# Altium schematic sheet PSU.SchDoc
size A3; SheetNumber: 4; SheetTotal: 8
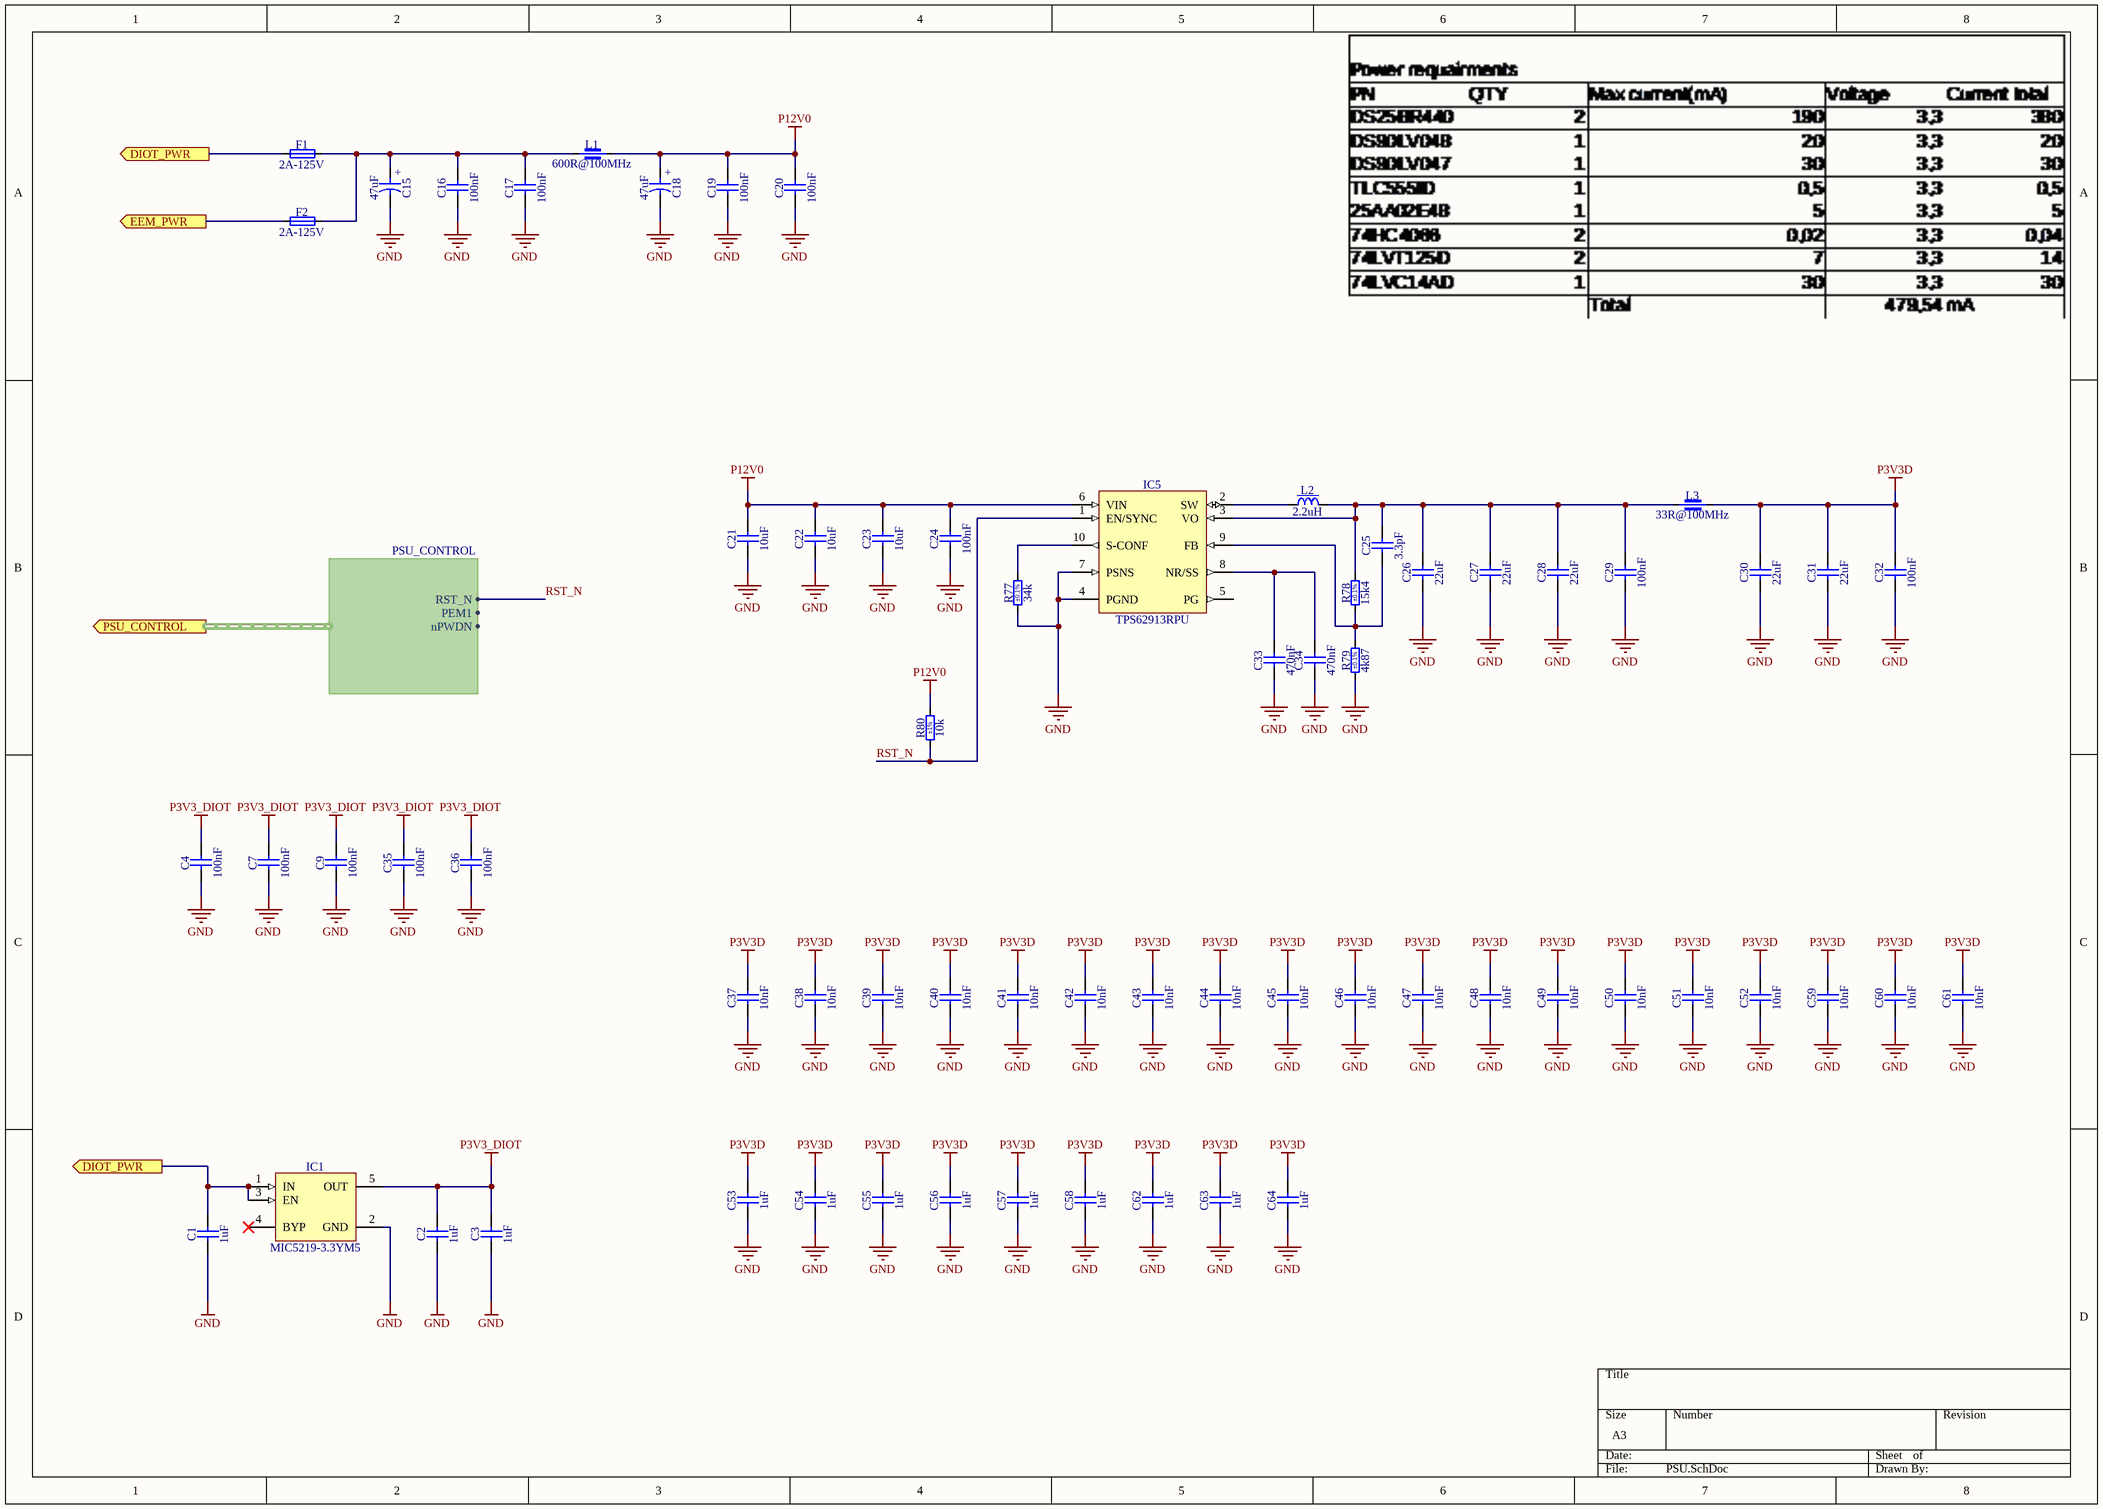
[diagram p0: PSU.SchDoc]

## Parts
C1  1uF  [CAPC1608X87N]
C2  1uF  [CAPC1005X55N]
C3  1uF  [CAPC1005X55N]
C4  100nF  [CAPC1005X55N]
C7  100nF  [CAPC1005X55N]
C9  100nF  [CAPC1005X55N]
C15  47uF  [CAPMP7343X310N]
C16  100nF  [CAPC1608X90N]
C17  100nF  [CAPC1608X90N]
C18  47uF  [CAPMP7343X310N]
C19  100nF  [CAPC1608X90N]
C20  100nF  [CAPC1608X90N]
C21  10uF  [CAPC3216X180N]
C22  10uF  [CAPC3216X180N]
C23  10uF  [CAPC3216X180N]
C24  100nF  [CAPC2012X135N]
C25  3.3pF  [CAPC1608X87N]
C26  22uF  [CAPC3216X180N]
C27  22uF  [CAPC3216X180N]
C28  22uF  [CAPC3216X180N]
C29  100nF  [CAPC3216X180N]
C30  22uF  [CAPC3216X180N]
C31  22uF  [CAPC3216X180N]
C32  100nF  [CAPC3216X180N]
C33  470nF  [CAPC1608X90N]
C34  470nF  [CAPC1608X90N]
C35  100nF  [CAPC1005X55N]
C36  100nF  [CAPC1005X55N]
C37  10nF  [CAPC1005X55N]
C38  10nF  [CAPC1005X55N]
C39  10nF  [CAPC1005X55N]
C40  10nF  [CAPC1005X55N]
C41  10nF  [CAPC1005X55N]
C42  10nF  [CAPC1005X55N]
C43  10nF  [CAPC1005X55N]
C44  10nF  [CAPC1005X55N]
C45  10nF  [CAPC1005X55N]
C46  10nF  [CAPC1005X55N]
C47  10nF  [CAPC1005X55N]
C48  10nF  [CAPC1005X55N]
C49  10nF  [CAPC1005X55N]
C50  10nF  [CAPC1005X55N]
C51  10nF  [CAPC1005X55N]
C52  10nF  [CAPC1005X55N]
C53  1uF  [CAPC2012X135N]
C54  1uF  [CAPC2012X135N]
C55  1uF  [CAPC2012X135N]
C56  1uF  [CAPC2012X135N]
C57  1uF  [CAPC2012X135N]
C58  1uF  [CAPC2012X135N]
C59  10nF  [CAPC1005X55N]
C60  10nF  [CAPC1005X55N]
C61  10nF  [CAPC1005X55N]
C62  1uF  [CAPC2012X135N]
C63  1uF  [CAPC2012X135N]
C64  1uF  [CAPC2012X135N]
F1  2A-125V  [FUSE_LITTELFUSE_0154]
F2  2A-125V  [FUSE_LITTELFUSE_0154]
IC1  MIC5219-3.3YM5  [SOT95P280X145-5N]
IC5  TPS62913RPU  [TEXAS_RPU0010A]
L1  600R@100MHz  [INDC2012X110N]
L2  2.2uH  [IND_WURTH_WE-MAPI_4020]
L3  33R@100MHz  [IND_KEMET_Z0805PWS]
R77  34k  Tolerance: ±0.1%  [RESC1608X55N]
R78  15k4  Tolerance: ±0.1%  [RESC1608X55N]
R79  4k87  Tolerance: ±0.1%  [RESC1608X55N]
R80  10k  Tolerance: ±1%  [RESC1608X55N]

## Ports
DIOT_PWR (out, see BLOCK_DIAGRAM[5B], DIOT_CONN[1A]), EEM_PWR (out, see BLOCK_DIAGRAM[5B], EEM_CONN[5D]), PSU_CONTROL (out, harness PSU_CONTROL, see BLOCK_DIAGRAM[5B], SYSTEM[1C])

## Harnesses
PSU_CONTROL: RST_N, PEM1, nPWDN

## Nets
GND: C1.1 C2.1 C3.1 C4.1 C7.1 C9.1 C15.2 C16.1 C17.1 C18.2 C19.1 C20.1 C21.1 C22.1 C23.1 C24.1 C26.1 C27.1 C28.1 C29.1 C30.1 C31.1 C32.1 C33.1 C34.1 C35.1 C36.1 C37.1 C38.1 C39.1 C40.1 C41.1 C42.1 C43.1 C44.1 C45.1 C46.1 C47.1 C48.1 C49.1 C50.1 C51.1 C52.1 C53.1 C54.1 C55.1 C56.1 C57.1 C58.1 C59.1 C60.1 C61.1 C62.1 C63.1 C64.1 IC1.2(GND) IC5.4(PGND) IC5.7(PSNS) R77.1 R79.1
P3V3_DIOT: C2.2 C3.2 C4.2 C7.2 C9.2 C35.2 C36.2 IC1.5(OUT)
P3V3D: C30.2 C31.2 C32.2 C37.2 C38.2 C39.2 C40.2 C41.2 C42.2 C43.2 C44.2 C45.2 C46.2 C47.2 C48.2 C49.2 C50.2 C51.2 C52.2 C53.2 C54.2 C55.2 C56.2 C57.2 C58.2 C59.2 C60.2 C61.2 C62.2 C63.2 C64.2 L3.2
P12V0: C18.1 C19.2 C20.2 C21.2 C22.2 C23.2 C24.2 IC5.6(VIN) L1.2 R80.2
DIOT_PWR: C1.2 F1.1 IC1.1(IN) IC1.3(EN) ; port DIOT_PWR
EEM_PWR: F2.1 ; port EEM_PWR
RST_N: IC5.1(EN/SYNC) R80.1 ; port PSU_CONTROL.RST_N
NetC15_1: C15.1 C16.2 C17.2 F1.2 F2.2 L1.1
NetC25_1: C25.1 IC5.9(FB) R78.1 R79.2
NetC25_2: C25.2 C26.2 C27.2 C28.2 C29.2 IC5.3(VO) L2.2 L3.1 R78.2
NetC33_2: C33.2 C34.2 IC5.8(NR/SS)
NetIC5_2: IC5.2(SW) L2.1
NetIC5_10: IC5.10(S-CONF) R77.2

Not connected (* = marked no-connect by the designer): IC1 4(BYP)*; IC5 5(PG)

## Notes on the sheet
- (in symbol CTE7343-31_47UF_25V_10%) +

## Library data of the parts
C1 = CC0603_1UF_25V_10%_X7R: Non-polarised capacitor; Part Description: SMD Multilayer Chip Ceramic Capacitor; Manufacturer: GENERIC; Manufacturer1 Part Number: GRM188R71E105KA12D; Voltage: 25V; TC: X7R; Tolerance: ±10%; Part Number: CC0603_1UF_25V_10%_X7R; Component Kind: Standard; Component Type: Standard; Pin Count: 2; Value: 1uF; Status: None; Manufacturer Part Number: CC0603_1UF_25V_10%_X7R; Case: 0603; Mounted: Yes; Socket: No; SMD: Yes; Sense: No; Manufacturer1 Example: MURATA; Manufacturer1 ComponentHeight: 0.9mm; HelpURL: \\cern.ch\dfs\Applications\Altium\Datasheets\CC0603_X7R_MURATA.pdf; Author: CERN DEM JLC; CreateDate: 18.01.2011; LatestRevisionDate: 18.01.2011
C2 C3 = CC0402_1UF_16V_10%_X5R: Non-polarised capacitor; Part Description: SMD Multilayer Chip Ceramic Capacitor; Manufacturer: GENERIC; Manufacturer1 Part Number: C1005X5R1C105KT; Voltage: 16V; TC: X5R; Tolerance: ±10%; Part Number: CC0402_1UF_16V_10%_X5R; Component Kind: Standard; Component Type: Standard; Pin Count: 2; Value: 1uF; Status: Preferred; Manufacturer Part Number: CC0402_1UF_16V_10%_X5R; Case: 0402; Mounted: Yes; Socket: No; SMD: Yes; Sense: No; Manufacturer1 Example: TDK; Manufacturer1 ComponentHeight: 0.55mm; HelpURL: \\cern.ch\dfs\Applications\Altium\Datasheets\CC0402_X5R_TDK_C.pdf; Author: CERN DEM JLC; CreateDate: 25.10.2012; LatestRevisionDate: 25.10.2012
C4 C7 C9 C35 C36 = CC0402_100NF_16V_10%_X5R: Non-polarised capacitor; Part Description: SMD Multilayer Chip Ceramic Capacitor; Manufacturer: GENERIC; Manufacturer1 Part Number: GRM155R61C104KA88D; Voltage: 16V; TC: X5R; Tolerance: ±10%; Part Number: CC0402_100NF_16V_10%_X5R; Component Kind: Standard; Component Type: Standard; Pin Count: 2; Value: 100nF; Status: None; Manufacturer Part Number: CC0402_100NF_16V_10%_X5R; Case: 0402; Mounted: Yes; Socket: No; SMD: Yes; Sense: No; Manufacturer1 Example: MURATA; Manufacturer1 ComponentHeight: 0.55mm; HelpURL: \\cern.ch\dfs\Applications\Altium\Datasheets\CC0402_X5R_MURATA_GRM.pdf; Author: CERN DEM JLC; CreateDate: 10.12.2013; LatestRevisionDate: 10.12.2013
C15 C18 = CTE7343-31_47UF_25V_10%: Polarised capacitor; Part Description: Solid Tantalum Chip Capacitor; Manufacturer: GENERIC; Manufacturer1 Part Number: TAJD476K025R; Voltage: 25V; Tolerance: ±10%; Part Number: CTE7343-31_47UF_25V_10%; Component Kind: Standard; Component Type: Standard; Pin Count: 2; Value: 47uF; Status: Preferred; Manufacturer Part Number: CTE7343-31_47UF_25V_10%; Case: D; Mounted: Yes; Socket: No; SMD: Yes; Sense: No; Manufacturer1 Example: AVX; Manufacturer1 ComponentHeight: 3.1mm; HelpURL: \\cern.ch\dfs\Applications\Altium\Datasheets\CTE_AVX_TAJ.pdf; Author: CERN DEM JLC; CreateDate: 03.12.2007; LatestRevisionDate: 03.12.2007
C16 C17 C19 C20 = CC0603_100NF_100V_10%_X7R: Non-polarised capacitor; Part Description: SMD Multilayer Chip Ceramic Capacitor; Manufacturer: GENERIC; Manufacturer1 Part Number: GRM188R72A104KA35D; Voltage: 100V; TC: X7R; Tolerance: ±10%; Part Number: CC0603_100NF_100V_10%_X7R; Component Kind: Standard; Component Type: Standard; Pin Count: 2; Value: 100nF; Status: None; Manufacturer Part Number: CC0603_100NF_100V_10%_X7R; Case: 0603; Mounted: Yes; Socket: No; SMD: Yes; Sense: No; Manufacturer1 Example: MURATA; Manufacturer1 ComponentHeight: 0.9mm; HelpURL: \\cern.ch\dfs\Applications\Altium\Datasheets\CC0603_MURATA_GRM188R72A104KA35D.pdf; Author: CERN DEM JLC; CreateDate: 11.12.2013; LatestRevisionDate: 11.12.2013
C21-C23 = CC1206_10UF_25V_10%_X7R: Non-polarised capacitor; Part Description: SMD Multilayer Chip Ceramic Capacitor; Manufacturer: GENERIC; Manufacturer1 Part Number: C1206C106K4RACTU; Voltage: 25V; TC: X7R; Tolerance: ±10%; Part Number: CC1206_10UF_25V_10%_X7R; Component Kind: Standard; Component Type: Standard; Pin Count: 2; Value: 10uF; Status: Preferred; Manufacturer Part Number: CC1206_10UF_25V_10%_X7R; Case: 1206; Mounted: Yes; Socket: No; SMD: Yes; Sense: No; Manufacturer1 Example: KEMET; Manufacturer1 ComponentHeight: 1.8mm; HelpURL: \\cern.ch\dfs\Applications\Altium\Datasheets\CC1206_X7R_KEMET.pdf; Author: CERN DEM JLC; CreateDate: 12.09.2012; LatestRevisionDate: 12.09.2012
C24 = CC0805_100NF_50V_10%_X7R: Non-polarised capacitor; Part Description: SMD Multilayer Chip Ceramic Capacitor; Manufacturer: GENERIC; Manufacturer1 Part Number: C2012X7R1H104K085; Voltage: 50V; TC: X7R; Tolerance: ±10%; Part Number: CC0805_100NF_50V_10%_X7R; Component Kind: Standard; Component Type: Standard; Pin Count: 2; Value: 100nF; Status: None; Manufacturer Part Number: CC0805_100NF_50V_10%_X7R; Case: 0805; Mounted: Yes; Socket: No; SMD: Yes; Sense: No; Manufacturer1 Example: TDK; Manufacturer1 ComponentHeight: 1mm; HelpURL: \\cern.ch\dfs\Applications\Altium\Datasheets\CC0805_X7R_TDK_C.pdf; Author: CERN DEM JLC; CreateDate: 03.12.2007; LatestRevisionDate: 22.04.2015
C25 = CC0603_3.3PF_50V_0.25PF_NP0: Non-polarised capacitor; Part Description: SMD Multilayer Chip Ceramic Capacitor; Manufacturer: GENERIC; Manufacturer1 Part Number: 223886715338; Voltage: 50V; TC: C0G/NP0; Tolerance: ±0.25pF; Part Number: CC0603_3.3PF_50V_0.25PF_NP0; Component Kind: Standard; Component Type: Standard; Pin Count: 2; Value: 3.3pF; Status: Preferred; Manufacturer Part Number: CC0603_3.3PF_50V_0.25PF_NP0; Case: 0603; Mounted: Yes; Socket: No; SMD: Yes; Sense: No; Manufacturer1 Example: PHYCOMP; Manufacturer1 ComponentHeight: 0.87mm; HelpURL: \\cern.ch\dfs\Applications\Altium\Datasheets\CC0603_NP0_PHYCOMP.pdf; Author: CERN DEM JLC; CreateDate: 03.12.2007; LatestRevisionDate: 03.12.2007
C26-C28 C30 C31 = CC1206_22UF_10V_10%_X7R: Non-polarised capacitor; Part Description: SMD Multilayer Chip Ceramic Capacitor; Manufacturer: GENERIC; Manufacturer1 Part Number: GRM31CR71A226KE15L; Voltage: 10V; TC: X7R; Tolerance: ±10%; Part Number: CC1206_22UF_10V_10%_X7R; Component Kind: Standard; Component Type: Standard; Pin Count: 2; Value: 22uF; Status: Preferred; Manufacturer Part Number: CC1206_22UF_10V_10%_X7R; Case: 1206; Mounted: Yes; Socket: No; SMD: Yes; Sense: No; Manufacturer1 Example: MURATA; Manufacturer1 ComponentHeight: 1.8mm; HelpURL: \\cern.ch\dfs\Applications\Altium\Datasheets\CC1206_X7R_MURATA_GRM-HI-CAP.pdf; Author: CERN DEM JLC; CreateDate: 08.06.2010; LatestRevisionDate: 08.06.2010
C29 C32 = CC1206_100NF_50V_5%_C0G_TDK_CGA5L2C0G1H104J160AA: Non-polarised capacitor; Part Description: SMD Multilayer Chip Ceramic Capacitor (Automotive Grade); Manufacturer: TDK; Voltage: 50V; TC: C0G/NP0; Tolerance: ±5%; Part Number: CC1206_100NF_50V_5%_C0G_TDK_CGA5L2C0G1H104J160AA; Component Kind: Standard; Component Type: Standard; Pin Count: 2; Value: 100nF; Status: Not Recommended; Manufacturer Part Number: CGA5L2C0G1H104J160AA; Case: 1206; Mounted: Yes; Socket: No; SMD: Yes; Sense: No; ComponentHeight: 1.8mm; HelpURL: \\cern.ch\dfs\Applications\Altium\Datasheets\CC1206_C0G_TDK_CGA(up to 50V).pdf; Author: CERN DEM BC; CreateDate: 18.04.2016; LatestRevisionDate: 24.01.2018
C33 C34 = CC0603_470NF_16V_10%_X7R: Non-polarised capacitor; Part Description: SMD Multilayer Chip Ceramic Capacitor; Manufacturer: GENERIC; Manufacturer1 Part Number: CC0603KRX7R7BB474; Voltage: 16V; TC: X7R; Tolerance: ±10%; Part Number: CC0603_470NF_16V_10%_X7R; Component Kind: Standard; Component Type: Standard; Pin Count: 2; Value: 470nF; Status: Preferred; Manufacturer Part Number: CC0603_470NF_16V_10%_X7R; Case: 0603; Mounted: Yes; Socket: No; SMD: Yes; Sense: No; Manufacturer1 Example: YAGEO PHYCOMP; Manufacturer1 ComponentHeight: 0.9mm; HelpURL: \\cern.ch\dfs\Applications\Altium\Datasheets\CC0603_X7R_YAGEO.pdf; Author: CERN DEM BC; CreateDate: 12.11.2019; LatestRevisionDate: 12.11.2019
C37-C52 C59-C61 = CC0402_10NF_16V_10%_X7R: Non-polarised capacitor; Part Description: SMD Multilayer Chip Ceramic Capacitor; Manufacturer: GENERIC; Manufacturer1 Part Number: 223878715636; Voltage: 16V; TC: X7R; Tolerance: ±10%; Part Number: CC0402_10NF_16V_10%_X7R; Component Kind: Standard; Component Type: Standard; Pin Count: 2; Value: 10nF; Status: Not Recommended; Manufacturer Part Number: CC0402_10NF_16V_10%_X7R; Case: 0402; Mounted: Yes; Socket: No; SMD: Yes; Sense: No; Manufacturer1 Example: PHYCOMP; Manufacturer1 ComponentHeight: 0.55mm; HelpURL: \\cern.ch\dfs\Applications\Altium\Datasheets\CC0402_X7R_PHYCOMP.pdf; Author: CERN DEM JLC; CreateDate: 03.12.2007; LatestRevisionDate: 03.12.2007
C53-C58 C62-C64 = CC0805_1UF_16V_10%_X7R: Non-polarised capacitor; Part Description: SMD Multilayer Chip Ceramic Capacitor; Manufacturer: GENERIC; Manufacturer1 Part Number: C2012X7R1C105K125; Voltage: 16V; TC: X7R; Tolerance: ±10%; Part Number: CC0805_1UF_16V_10%_X7R; Component Kind: Standard; Component Type: Standard; Pin Count: 2; Value: 1uF; Status: Preferred; Manufacturer Part Number: CC0805_1UF_16V_10%_X7R; Case: 0805; Mounted: Yes; Socket: No; SMD: Yes; Sense: No; Manufacturer1 Example: TDK; Manufacturer1 ComponentHeight: 1.45mm; HelpURL: \\cern.ch\dfs\Applications\Altium\Datasheets\CC0805_X7R_TDK_C.pdf; Author: CERN DEM JLC; CreateDate: 03.12.2007; LatestRevisionDate: 22.04.2015
F1 F2 = FUSE_LITTELFUSE_0154002.DR: Fuse; Part Description: SMF OMNI-BLOK® Very Fast-Acting Fuse and Holder; PressFit: No; Part Number: FUSE_LITTELFUSE_0154002.DR; Component Kind: Standard; Component Type: Standard; Pin Count: 2; PackageDescription: SMF Fuse and Holder, 2-Leads, Body 9.73x5.03mm; Family: Fuse & Holder; Mounted: Yes; Socket: No; SMD: Yes; Sense: No; Value: 2A-125V; Manufacturer: LITTELFUSE; Manufacturer Part Number: 0154002.DR; ComponentHeight: 3.81mm; HelpURL: \\cern.ch\dfs\Applications\Altium\Datasheets\FUSE_LITTELFUSE_0154.pdf; Author: CERN DEM JMW; CreateDate: 30.07.2009; LatestRevisionDate: 30.07.2009
IC1 = MIC5219-3.3YM5: 500mA Peak Output LDO Regulator; Part Description: 3.3V 500mA Peak Output Low Drop-Out  (LDO) Regulator; Manufacturer: MICROCHIP TECHNOLOGY; PressFit: No; Bonding: No; Part Number: MIC5219-3.3YM5; Component Kind: Standard; Component Type: Standard; Device: MIC5219-3.3YM5; PackageDescription: SOT, 0.95mm pitch; 5 pin, 1.60mm W X 2.90mm L X 1.45mm H body, IPC Medium Density; Manufacturer Part Number: MIC5219-3.3YM5; Pin Count: 5; Case: SOT23-5; Mounted: Yes; Socket: No; SMD: Yes; Sense: No; ComponentHeight: 1.45mm; HelpURL: \\cern.ch\dfs\Applications\Altium\Datasheets\MIC5219-3.3YM5.pdf; Author: CERN DEM WB; CreateDate: 2019-04-16; LatestRevisionDate: 2019-04-16
IC5 = TPS62913RPU: 3V to 17V, 2A/3A Low Noise and Low Ripple Buck Converter with Integrated Ferrite Bead Filter Compensation; Part Description: 3V to 17V, 3A Low Noise and Low Ripple Buck Converter with Integrated Ferrite Bead Filter Compensation; Manufacturer: TEXAS INSTRUMENTS; PressFit: No; Bonding: No; Part Number: TPS62913RPU; Component Kind: Standard; Component Type: Standard; Device: TPS62913RPU; PackageDescription: TEXAS Case Style RPU0010A, QFN, 0.50mm Pitch, 10 Pin, 2.00mm W X 2.00mm L X 1.00mm H body; Manufacturer Part Number: TPS62913RPU; Pin Count: 10; Case: QFN10; Mounted: Yes; Socket: No; SMD: Yes; Sense: No; ComponentHeight: 1mm; HelpURL: \\cern.ch\dfs\Applications\Altium\Datasheets\TPS62913RPU.pdf; Author: CERN DEM BC; CreateDate: 09.07.2021; LatestRevisionDate: 09.07.2021
L1 = IND0805_WURTH_742792040: Part Description: SMD EMI Suppression Chip Ferrite Bead (WE-CBF Series); Manufacturer: WURTH ELEKTRONIK; Power: 2A; Resistance: 0.150R; Tolerance: ±25%; Part Number: IND0805_WURTH_742792040; Component Kind: Standard; Component Type: Standard; Pin Count: 2; Value: 600R@100MHz; Manufacturer Part Number: 742792040; Case: 0805; Mounted: Yes; Socket: No; SMD: Yes; Sense: No; ComponentHeight: 1.1mm; HelpURL: \\cern.ch\dfs\Applications\Altium\Datasheets\IND0805_WURTH_742792040.pdf; Author: CERN DEM JLC; CreateDate: 10.05.2010; LatestRevisionDate: 25.10.2018
L2 = IND_2.2UH_20%_WURTH_WE-MAPI-74438356022: Inductor With Core; Part Description: SMT Power Inductor,  WURTH WE-MAPI Series; Manufacturer: WURTH ELEKTRONIK; Power: 4.7A; Resistance: 0.035R; Tolerance: ±20%; Part Number: IND_2.2UH_20%_WURTH_WE-MAPI-74438356022; Component Kind: Standard; Component Type: Standard; Pin Count: 2; Value: 2.2uH; Manufacturer Part Number: 74438356022; Mounted: Yes; Socket: No; SMD: Yes; Sense: No; ComponentHeight: 2.1mm; HelpURL: \\cern.ch\dfs\Applications\Altium\Datasheets\IND_WURTH_WE-MAPI_74438356022.pdf; Author: CERN DEM HF; CreateDate: 06.07.2023; LatestRevisionDate: 06.07.2023
L3 = IND0805_KEMET_Z0805C330BPWS: Part Description: Power Line Ferrite Chip Bead; Manufacturer: KEMET; Power: 4A; Resistance: 0.008R; Tolerance: ±25%; Part Number: IND0805_KEMET_Z0805C330BPWS; Component Kind: Standard; Component Type: Standard; Pin Count: 2; Value: 33R@100MHz; Manufacturer Part Number: Z0805C330BPWS; Case: 0805; Mounted: Yes; Socket: No; SMD: Yes; Sense: No; ComponentHeight: 1.05mm; HelpURL: \\cern.ch\dfs\Applications\Altium\Datasheets\IND0805_KEMET_Z-PWS .pdf; Author: CERN DEM JMW; CreateDate: 30.07.2021; LatestRevisionDate: 30.07.2021
R77 = R0603_34K_0.1%_0.063W_10PPM: Resistor - 0.1%; Part Description: Thin Film Chip Resistor; Manufacturer: GENERIC; Manufacturer1 Part Number: RN73C1J34KBTDF; Power: 0.063W; TC: ±10ppm; PressFit: No; Part Number: R0603_34K_0.1%_0.063W_10PPM; Component Kind: Standard; Component Type: Standard; Pin Count: 2; Value: 34k; Status: Not Recommended; Manufacturer Part Number: R0603_34K_0.1%_0.063W_10PPM; Case: 0603; Mounted: Yes; Sense: No; Socket: No; SMD: Yes; Manufacturer1 Example: TYCO HOLSWORTHY; Manufacturer1 ComponentHeight: 0.5mm; HelpURL: \\cern.ch\dfs\Applications\Altium\Datasheets\R0603_Tyco_RN73.pdf; Author: CERN DEM JLC; CreateDate: 03.12.2007; LatestRevisionDate: 13.03.2008
R78 = R0603_15K4_0.1%_0.063W_10PPM: Resistor - 0.1%; Part Description: Thin Film Chip Resistor; Manufacturer: GENERIC; Manufacturer1 Part Number: RN73C1J15K4BTDF; Power: 0.063W; TC: ±10ppm; PressFit: No; Part Number: R0603_15K4_0.1%_0.063W_10PPM; Component Kind: Standard; Component Type: Standard; Pin Count: 2; Value: 15k4; Status: Not Recommended; Manufacturer Part Number: R0603_15K4_0.1%_0.063W_10PPM; Case: 0603; Mounted: Yes; Sense: No; Socket: No; SMD: Yes; Manufacturer1 Example: TYCO HOLSWORTHY; Manufacturer1 ComponentHeight: 0.5mm; HelpURL: \\cern.ch\dfs\Applications\Altium\Datasheets\R0603_Tyco_RN73.pdf; Author: CERN DEM JLC; CreateDate: 03.12.2007; LatestRevisionDate: 13.03.2008
R79 = R0603_4K87_0.1%_0.063W_10PPM: Resistor - 0.1%; Part Description: Thin Film Chip Resistor; Manufacturer: GENERIC; Manufacturer1 Part Number: RN73C1J4K87BTDF; Power: 0.063W; TC: ±10ppm; PressFit: No; Part Number: R0603_4K87_0.1%_0.063W_10PPM; Component Kind: Standard; Component Type: Standard; Pin Count: 2; Value: 4k87; Status: Not Recommended; Manufacturer Part Number: R0603_4K87_0.1%_0.063W_10PPM; Case: 0603; Mounted: Yes; Sense: No; Socket: No; SMD: Yes; Manufacturer1 Example: TYCO HOLSWORTHY; Manufacturer1 ComponentHeight: 0.5mm; HelpURL: \\cern.ch\dfs\Applications\Altium\Datasheets\R0603_Tyco_RN73.pdf; Author: CERN DEM JLC; CreateDate: 03.12.2007; LatestRevisionDate: 13.03.2008
R80 = R0603_10K_1%_0.1W_100PPM: Resistor - 1%; Part Description: General Purpose Thick Film Chip Resistor; Manufacturer: GENERIC; Manufacturer1 Part Number: NRC06F1002TRF; Power: 0.1W; TC: ±100ppm/°C; PressFit: No; Part Number: R0603_10K_1%_0.1W_100PPM; Component Kind: Standard; Component Type: Standard; Pin Count: 2; Value: 10k; Status: Preferred; Manufacturer Part Number: R0603_10K_1%_0.1W_100PPM; Case: 0603; Mounted: Yes; Sense: No; Socket: No; SMD: Yes; Manufacturer1 Example: NIC COMPONENT; Manufacturer1 ComponentHeight: 0.55mm; HelpURL: \\cern.ch\dfs\Applications\Altium\Datasheets\R0603_NIC_NRC.pdf; Author: CERN DEM JLC; CreateDate: 03.12.2007; LatestRevisionDate: 13.03.2008